# EAGLE schematic snes-bt (EAGLE 6.1)
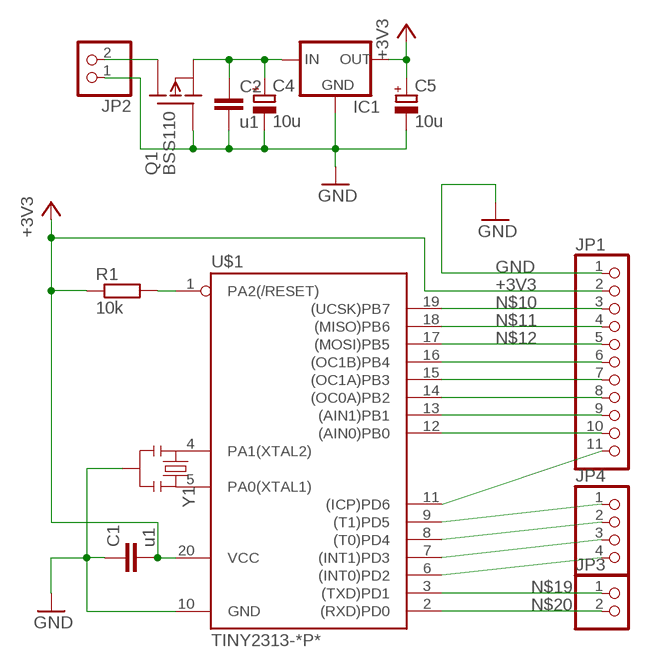
[diagram p0: schematic, sheet 1]

## Parts
C1  u1  C-EU025-025X050  [C025-025X050]
C2  u1  C-EU025-025X050  [C025-025X050]
C4  10u  CPOL-EUE2,5-6E  [E2,5-6E]
C5  10u  CPOL-EUE2,5-6E  [E2,5-6E]
IC1  MCP1700_TO92-THIN  [TO-92]
JP1  PINHD-1X11  [1X11]
JP2  PINHD-1X2  [1X02]
JP3  PINHD-1X2  [1X02]
JP4  PINHD-1X4  [1X04]
Q1  BSS110  [TO92]
R1  10k  R-EU_0204/7  [0204/7]
U$1  TINY2313-*P*  [DIL20]
Y1  RESONATORPTH  [RESONATOR-PTH]

## Nets
+3V3: C1.2 C5.+ IC1.3(OUT) JP1.2 R1.1 U$1.20(VCC)
GND: C1.1 C2.2 C4.- C5.- IC1.1(GND) JP1.1 JP2.1 Q1.2(G) U$1.10(GND) Y1.2
N$1: U$1.5(PA0(XTAL1)) Y1.3
N$2: U$1.4(PA1(XTAL2)) Y1.1
N$3: JP1.11 U$1.11((ICP)PD6)
N$5: C2.1 C4.+ IC1.2(IN) Q1.1(S)
N$6: JP2.2 Q1.3(D)
N$9: R1.2 U$1.1(PA2(/RESET))
N$10: JP1.3 U$1.19((UCSK)PB7)
N$11: JP1.4 U$1.18((MISO)PB6)
N$12: JP1.5 U$1.17((MOSI)PB5)
N$13: JP1.6 U$1.16((OC1B)PB4)
N$14: JP1.7 U$1.15((OC1A)PB3)
N$15: JP1.8 U$1.14((OC0A)PB2)
N$16: JP1.9 U$1.13((AIN1)PB1)
N$17: JP1.10 U$1.12((AIN0)PB0)
N$19: JP3.1 U$1.3((TXD)PD1)
N$20: JP3.2 U$1.2((RXD)PD0)
N$21: JP4.1 U$1.9((T1)PD5)
N$22: JP4.2 U$1.8((T0)PD4)
N$23: JP4.3 U$1.7((INT1)PD3)
N$24: JP4.4 U$1.6((INT0)PD2)

## Library data of the parts
C1 C2 = rcl:C-EU: CAPACITOR, European symbol
C4 C5 = rcl:CPOL-EU: POLARIZED CAPACITOR, European symbol
IC1 = _MY_OWN_LIB:MCP1700: VOLTAGE REGULATOR
JP1 = pinhead:PINHD-1X11: PIN HEADER
JP2 JP3 = pinhead:PINHD-1X2: PIN HEADER
JP4 = pinhead:PINHD-1X4: PIN HEADER
Q1 = transistor-fet:BSS110: P-Channel Enhancement MOSFET -50V; -0,17A; 6Ohm
R1 = rcl:R-EU_: RESISTOR, European symbol
U$1 = avr-7:TINY2313*: Atmel Tiny2313 2K Flash, 128 bytes EEPROM, 128 bytes RAM
Y1 = SparkFun-FreqCtrl:RESONATOR: Resonator Small SMD resonator. Used, eg, on the Arduino Pro/ Pro Mini boards. 8MHz- XTAL-08895 16MHz- XTAL-08900